# EAGLE design Cansat2019_1516_Container_v01 (EAGLE 7.3.0)
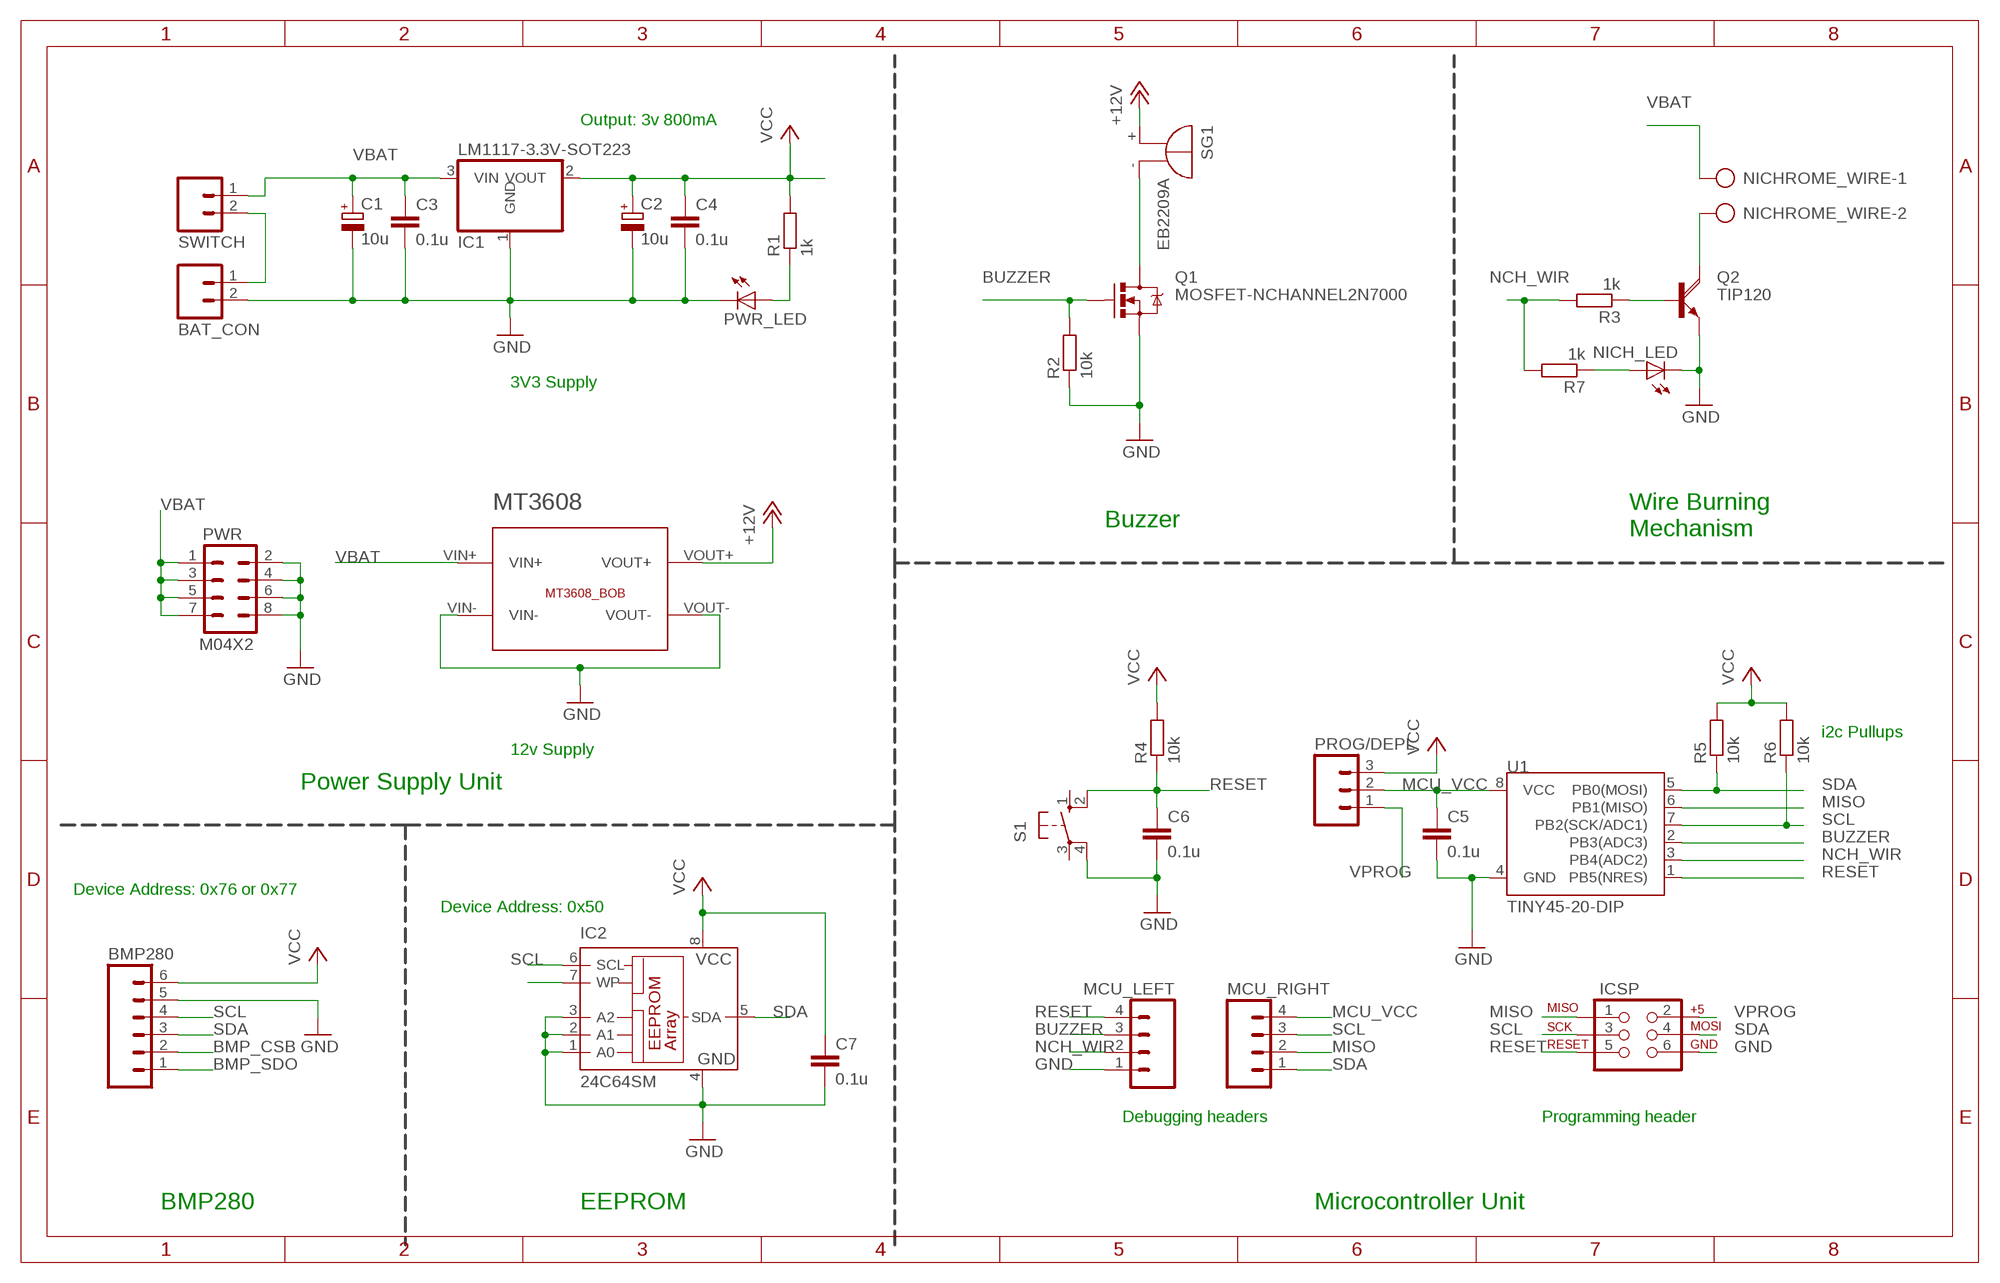
[diagram p0: schematic, sheet 1]

## Parts
BAT_CON  M02  [02P]
BMP280  M06  [06P]
C1  10u  CPOL-EUE2.5-6  [E2,5-6]
C2  10u  CPOL-EUE2.5-6  [E2,5-6]
C3  0.1u  C-EU025-025X050  [C025-025X050]
C4  0.1u  C-EU025-025X050  [C025-025X050]
C5  0.1u  C-EU025-025X050  [C025-025X050]
C6  0.1u  C-EU025-025X050  [C025-025X050]
C7  0.1u  C-EU025-025X050  [C025-025X050]
IC1  LM1117-3.3V-SOT223  [SOT223]
IC2  24C64SM  [SO-08M]
ICSP  AVR_SPI_PRG_6NS  [2X3-NS]
MCU_LEFT  M04  [04P]
MCU_RIGHT  M04  [04P]
MT3608  MT3608_BOB  [MT3608_BOB]
NICH_LED  LED3MM  [LED3MM]
NICHROME_WIRE  AK500/2-H  [AK500/2-H]
PROG/DEPL  M03PTH  [1X03]
PWR  M04X2  [2X4]
PWR_LED  LED3MM  [LED3MM]
Q1  MOSFET-NCHANNEL2N7000  [TO-92]
Q2  TIP120  [TO220AH]
R1  1k  R-EU_0204/7  [0204/7]
R2  10k  R-EU_0204/7  [0204/7]
R3  1k  R-EU_0204/7  [0204/7]
R4  10k  R-EU_0204/7  [0204/7]
R5  10k  R-EU_0204/7  [0204/7]
R6  10k  R-EU_0204/7  [0204/7]
R7  1k  R-EU_0204/7  [0204/7]
S1  PUSH-BUTTON-6MM  [B3F-10XX]
SG1  EB2209A  [EB2209A]
SWITCH  M02  [02P]
U1  TINY45-20-DIP  ATTINY45TINY45-20-DIP  [DIP08]

## Nets
+12V [power]: MT3608.VOUT+ SG1.+
BMP_CSB: BMP280.2
BMP_SDO: BMP280.1
BUZZER: MCU_LEFT.3 Q1.2(G) R2.2 U1.2(PB3(ADC3))
GND [power]: BAT_CON.2 BMP280.5 C1.- C2.- C3.2 C4.2 C5.2 C6.2 C7.2 IC1.1(GND) IC2.1(A0) IC2.2(A1) IC2.3(A2) IC2.4(GND) ICSP.6 MCU_LEFT.1 MT3608.VIN- MT3608.VOUT- NICH_LED.K(C) PWR.2 PWR.4 PWR.6 PWR.8 PWR_LED.K(C) Q1.1(S) Q2.E R2.1 S1.4(P1) U1.4(GND)
MCU_VCC [power]: C5.1 MCU_RIGHT.4 PROG/DEPL.2 U1.8(VCC)
MISO: ICSP.1 MCU_RIGHT.2 U1.6(PB1(MISO))
N$1 [power]: Q1.3(D) SG1.-
N$2 [burner]: NICHROME_WIRE.2 Q2.C
N$3: PWR_LED.A R1.1
N$4: Q2.B R3.1
N$5: NICH_LED.A R7.1
N$6 [burner]: BAT_CON.1 SWITCH.2
N$8: IC2.7(WP)
NCH_WIR: MCU_LEFT.2 R3.2 R7.2 U1.3(PB4(ADC2))
RESET: C6.1 ICSP.5 MCU_LEFT.4 R4.1 S1.2(S1) U1.1(PB5(NRES))
SCL: BMP280.4 IC2.6(SCL) ICSP.3 MCU_RIGHT.3 R6.1 U1.7(PB2(SCK/ADC1))
SDA: BMP280.3 IC2.5(SDA) ICSP.4 MCU_RIGHT.1 R5.1 U1.5(PB0(MOSI))
VBAT [burner]: C1.+ C3.1 IC1.3(VIN) MT3608.VIN+ NICHROME_WIRE.1 PWR.1 PWR.3 PWR.5 PWR.7 SWITCH.1
VCC [power]: BMP280.6 C2.+ C4.1 C7.1 IC1.2(VOUT) IC2.8(VCC) PROG/DEPL.3 R1.2 R4.2 R5.2 R6.2
VPROG [power]: ICSP.2 PROG/DEPL.1
Unconnected: S1.1(S) S1.3(P)

## Notes on the sheet
- Output: 3v 800mA
- 3V3 Supply
- Buzzer
- Wire Burning
  Mechanism
- i2c Pullups
- 12v Supply
- Power Supply Unit
- Device Address: 0x76 or 0x77
- Device Address: 0x50
- Debugging headers | Programming header
- BMP280 | EEPROM | Microcontroller Unit

## Library data of the parts
BAT_CON SWITCH = CEDT_JANUARY_2015_v5:M02: AMP QUICK CONNECTOR
BMP280 = con-amp-quick:M06: AMP QUICK CONNECTOR; OC_FARNELL: unknown; OC_NEWARK: unknown
C1 C2 = rcl:CPOL-EU: POLARIZED CAPACITOR, European symbol
C3-C7 = rcl:C-EU: CAPACITOR, European symbol
IC1 = msp framework:LM1117: LM1117 800mA Low Dropout (LDO) Positive Regulator 1.8V, 2.5V, 2.85V, 3.3V, 5V, and Adj Datasheet <www.ti.com/lit/ds/symlink/lm1117.pdf>; SUNROM: 4004
IC2 = microchip:24*: Serial EEPROM I2C; MF: RAMTRON INTERNATIONAL CORP; MPN: FM24C64-S; OC_FARNELL: 9882685; OC_NEWARK: 98H0189
ICSP = SparkFun-Connectors:AVR_SPI_PRG_6: AVR ISP 6 Pin This is the reduced ISP connector for AVR programming. Common on Arduino. This footprint will take up less PCB space and can be used with a 10-pin to 6-pin adapter such as SKU: BOB-08508 **Special note about "TEST_POINT" package. The stop mask is on the top side, so if you want your programming test points to be on the bottom of your board, make sure to place this package on the bottom side of the board. This also ensure that the orientation to program from the bottom side will be correct.
MCU_LEFT MCU_RIGHT = con-amp-quick:M04: AMP QUICK CONNECTOR; OC_FARNELL: unknown; OC_NEWARK: unknown
MT3608 = Breakouts:MT3608_BOB
NICH_LED PWR_LED = 01_adafruit:LED: LED OSRAM: - CHIPLED LG R971, LG N971, LY N971, LG Q971, LY Q971, LO R971, LY R971 LH N974, LH R974 LS Q976, LO Q976, LY Q976 LO Q996 - Hyper CHIPLED LW Q18S LB Q993, LB Q99A, LB R99A - SideLED LS A670, LO A670, LY A670, LG A670, LP A670 LB A673, LV A673, LT A673, LW A673 LH A674 LY A675 LS A676, LA A676, LO A676, LY A676, LW A676 LS A679, LY A679, LG A679 - Hyper Micro SIDELED® LS Y876, LA Y876, LO Y876, LY Y876 LT Y87S - SmartLED LW L88C, LW L88S LB L89C, LB L89S, LG L890 LS L89K, LO L89K, LY L89K LS L896, LA L896, LO L896, LY L896 - TOPLED LS T670, LO T670, LY T670, LG T670, LP T670 LSG T670, LSP T670, LSY T670, LOP T670, LYG T670 LG T671, LOG T671, LSG T671 LB T673, LV T673, LT T673, LW T673 LH T674 LS T676, LA T676, LO T676, LY T676, LB T676, LH T676, LSB T676, LW T676 LB T67C, LV T67C, LT T67C, LS T67K, LO T67K, LY T67K, LW E67C LS E67B, LA E67B, LO E67B, LY E67B, LB E67C, LV E67C, LT E67C LW T67C LS T679, LY T679, LG T679 LS T770, LO T770, LY T770, LG T770, LP T770 LB T773, LV T773, LT T773, LW T773 LH T774 LS E675, LA E675, LY E675, LS T675 LS T776, LA T776, LO T776, LY T776, LB T776 LHGB T686 LT T68C, LB T68C - Hyper Mini TOPLED® LB M676 - Mini TOPLED Santana® LG M470 LS M47K, LO M47K, LY M47K Source: http://www.osram.convergy.de/
NICHROME_WIRE = con-ptr500:AK500/2-H: CONNECTOR Aug. 2004 / PTR Meßtechnik: Die Bezeichnung der Serie AK505 wurde geändert. Es handelt sich hierbei um AK500 in horizontaler Ausführung.; OC_FARNELL: unknown; OC_NEWARK: unknown
PROG/DEPL = SparkFun-Connectors:M03: Header 3 Standard 3-pin 0.1" header. Use with straight break away headers (SKU : PRT-00116), right angle break away headers (PRT-00553), swiss pins (PRT-00743), machine pins (PRT-00117), and female headers (PRT-00115). Molex polarized connector foot print use with SKU : PRT-08232 with associated crimp pins and housings.
PWR = SparkFun-Connectors:M04X2: .1" header, two rows of four.
Q1 = SparkFun-DiscreteSemi:MOSFET-NCHANNEL: Common NMOSFET Parts MFG P/N Store ID Prod ID FDD8780 TRANS-09984 SI7820DN TRANS-11055 FDS6630A IC-08089 2N7002PW TRANS-11151 FQP30N06L COM-10213 TRANS-10060 BSS123LT1G TRANS-08345 BSS138 TRANS-00830 BS170 2N7000
Q2 = transistor-power:TIP120: NPN DARLINGTON TRANSISTOR
R1-R7 = rcl:R-EU_: RESISTOR, European symbol
S1 = msp framework:PUSH-BUTTON: Tactile Switch Momentary Push to ON switch Omron B3F 10-xx & 40-xx Datasheet <http://www.omron.com/ecb/products/pdf/en-b3f.pdf>; SUNROM: 3951
SG1 = buzzer:EB2209A: BUZZER Source: Buerklin; OC_FARNELL: unknown; OC_NEWARK: unknown
U1 = SparkFun-DigitalIC:ATTINY45: Atmel 8-pin 2/4/8kB flash uC; PROD_ID: IC-09439

## Net classes
0 default: width 0.305 mm, clearance 0.305 mm
1 power: width 0.61 mm, clearance 0.305 mm
2 burner: width 0.813 mm, clearance 0.305 mm

## Board
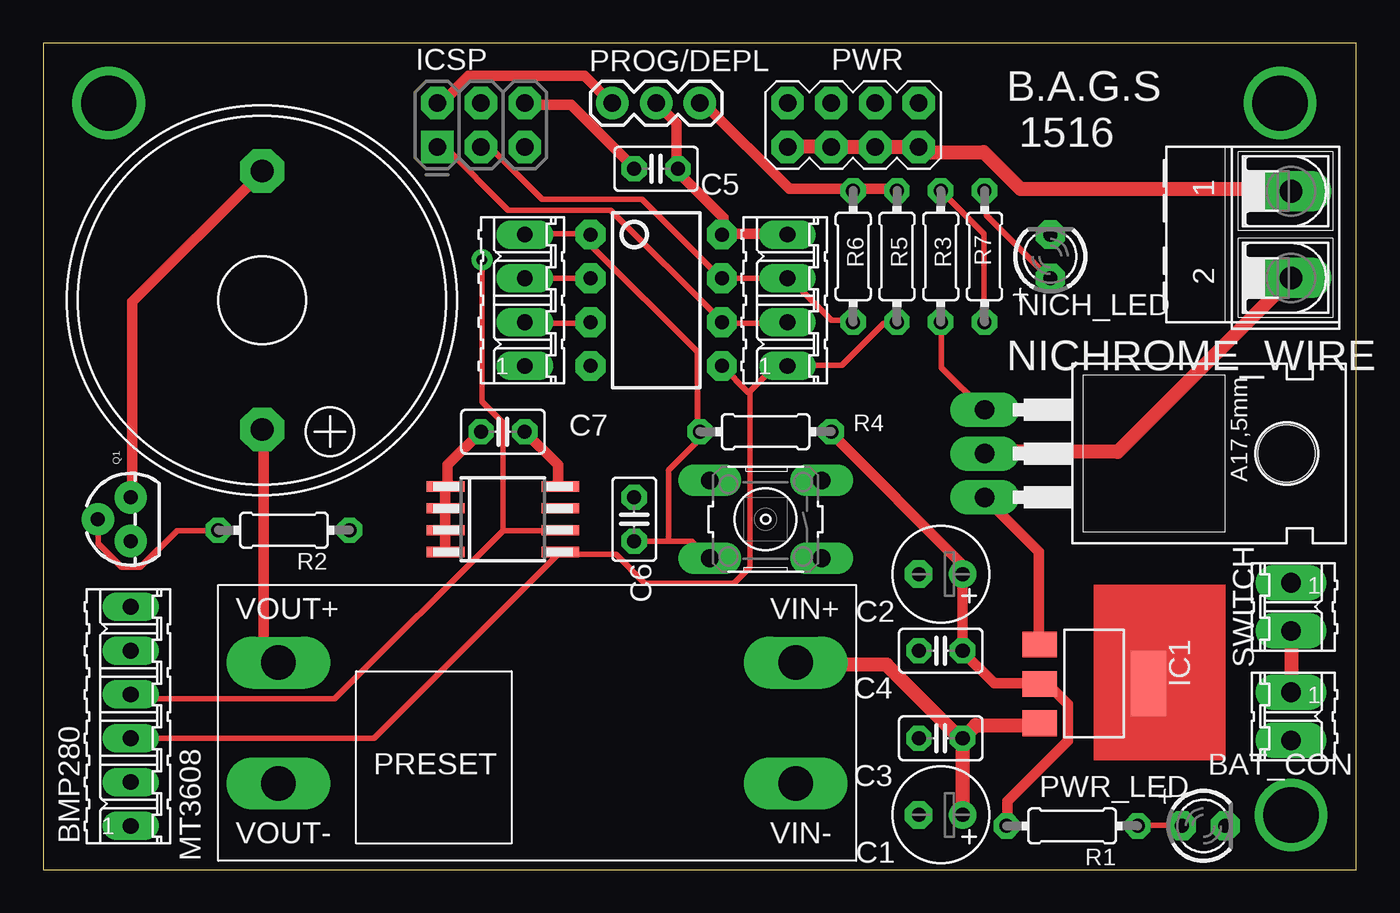
[diagram p1: board, top side]
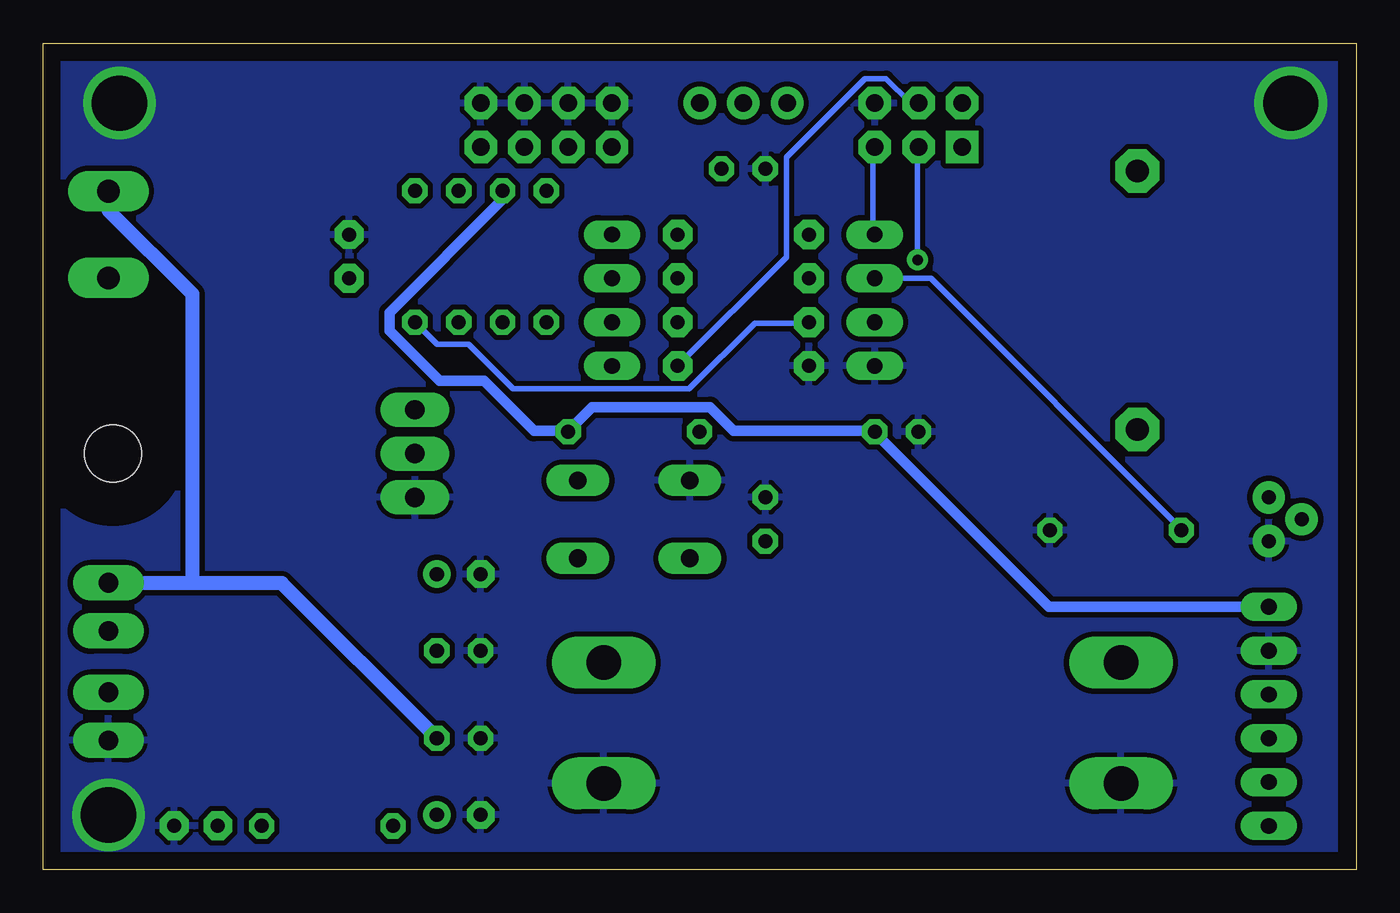
[diagram p2: board, bottom side, seen from below]

Size 76.18 x 47.93 mm. Coordinates in mm from the lower left corner, seen from the top.
Outline: 0,0 76.18,0 76.18,47.93 0,47.93 0,0
Copper layers (1*16): Top 0.035mm / dielectric 1.5mm / Bottom 0.035mm
Design rules "8085_board": minimum track width 10mil, minimum drill 24mil, track to track 8mil, track to pad 8mil, pad to pad 8mil, via to via 8mil, smd to smd 8mil, copper to edge 40mil, drill to drill 8mil, minimum pad ring 12mil, minimum via ring 12mil, stop-mask expansion 4mil, vias tented up to drill 0mil, thermal gap 10mil

### Footprints (pad centres in the part's own frame; a part is rotated, then mirrored left to right if it is on the bottom)
02P = drill 1.143 long: 1 -1.397,0; 2 1.397,0
06P = drill 0.914 long: 1 -6.35,0; 2 -3.81,0; 3 -1.27,0; 4 1.27,0; 5 3.81,0; 6 6.35,0
E2,5-6 = drill 0.813 pad 1.6: + -1.27,0 | drill 0.813 pad 1.6 octagon: - 1.27,0
C025-025X050 = drill 0.813 octagon: 1 -1.27,0; 2 1.27,0
SOT223 = smd 1.499 x 2.007: 1 -2.261,-3.15; 2 0.025,-3.15; 3 2.311,-3.15 | smd 3.81 x 2.007: 4 0,3.15
SO-08M = smd 0.6 x 2.2: 1 -1.905,-3.33; 2 -0.635,-3.33; 3 0.635,-3.33; 4 1.905,-3.33; 5 1.905,3.33; 6 0.635,3.33; 7 -0.635,3.33; 8 -1.905,3.33
2X3-NS = drill 1.016 pad 1.88 square: 1 -2.54,-1.27 | drill 1.016 pad 1.88 octagon: 2 -2.54,1.27; 3 0,-1.27; 4 0,1.27; 5 2.54,-1.27; 6 2.54,1.27
04P = drill 0.914 long: 1 -3.81,0; 2 -1.27,0; 3 1.27,0; 4 3.81,0
MT3608_BOB = drill 2 pad 3 long: VIN+ 33.5,-4.5; VIN- 33.5,-11.5; VOUT+ 3.5,-4.5; VOUT- 3.5,-11.5
LED3MM = drill 0.813 pad 1.676 octagon: A -1.27,0; K 1.27,0
AK500/2-H = drill 1.321 long: 1 -2.515,0; 2 2.515,0
1X03 = drill 1.016 pad 1.88: 1 0,0; 2 2.54,0; 3 5.08,0
2X4 = drill 1.016 pad 1.88 octagon: 1 -3.81,-1.27; 2 -3.81,1.27; 3 -1.27,-1.27; 4 -1.27,1.27; 5 1.27,-1.27; 6 1.27,1.27; 7 3.81,-1.27; 8 3.81,1.27
TO-92 = drill 0.813 pad 1.88: 1 -1.27,0; 2 0,1.905; 3 1.27,0
TO220AH = drill 1.118 long: B -2.54,-6.35; C 0,-6.35; E 2.54,-6.35 | hole 3.302: 0,11.176
0204/7 = drill 0.813 octagon: 1 -3.81,0; 2 3.81,0
B3F-10XX = drill 1.016 long: 1 -3.251,2.261; 2 3.251,2.261; 3 -3.251,-2.261; 4 3.251,-2.261
EB2209A = drill 1.321 pad 2.54 octagon: + 7.493,0; - -7.493,0
DIP08 = drill 0.813 pad 1.727 octagon: 1 -3.81,-3.81; 2 -1.27,-3.81; 3 1.27,-3.81; 4 3.81,-3.81; 5 3.81,3.81; 6 1.27,3.81; 7 -1.27,3.81; 8 -3.81,3.81

### Placement (x,y rotation side)
BAT_CON  72.39,8.89 270 top
BMP280  5.08,8.89 90 top
C1  52.07,3.17 180 top
C2  52.07,17.14 180 top
C3  52.07,7.62 180 top
C4  52.07,12.7 180 top
C5  35.56,40.64 180 top
C6  34.29,20.32 90 top
C7  26.67,25.4 180 top
IC1  60.96,10.79 270 top
IC2  26.67,20.32 270 top
ICSP  25.4,43.18 0 top
MCU_LEFT  27.94,33.02 90 top
MCU_RIGHT  43.18,33.02 90 top
MT3608  10.16,16.51 0 top
NICH_LED  58.42,35.56 90 top
NICHROME_WIRE  72.39,36.83 270 top
PROG/DEPL  33.02,44.45 0 top
PWR  46.99,43.18 0 top
PWR_LED  67.31,2.54 0 top
Q1  5.08,20.32 90 top
Q2  60.96,24.13 270 top
R1  59.69,2.54 180 top
R2  13.97,19.68 180 top
R3  52.07,35.56 90 top
R4  41.91,25.4 0 top
R5  49.53,35.56 90 top
R6  46.99,35.56 90 top
R7  54.61,35.56 270 top
S1  41.91,20.32 180 top
SG1  12.7,33.02 270 top
SWITCH  72.39,15.24 270 top
U1  35.56,33.02 270 top

### Tracks (layer width: path | path; a pad name or v marks a point on that pad's centre or on a via)
+12V
  Top 0.61: SG1.+ 12.8,25.45 12.8,12.8 13.56,12.04 MT3608.VOUT+
BUZZER
  Top 0.305: U1.2 MCU_LEFT.3 | R2.2 10.06,19.66 7.77,19.66 5.64,17.53 4.57,17.53 3.2,18.9 3.2,20.27 Q1.2
  Bottom 0.305: MCU_LEFT.3 24.69,34.29 10.21,19.81 R2.2
GND  (via drill 3.2)
  Top 0.61: IC2.4 23.32,18.44 23.32,19.66 IC2.3 23.32,19.96 23.32,20.88 IC2.2 23.32,21.18 23.32,22.1 IC2.1 23.47,22.4 23.47,23.47 C7.2 | Q2.E 57.76,18.44 57.76,13.11 IC1.1 | ICSP.6 28.04,44.35 30.63,44.35 34.29,40.69 C5.2
  other vias: 3.81,44.45 71.75,44.45 72.39,3.17
  pour Bottom: 1.27,48.26 1.27,0 76.2,0 76.2,48.26
MCU_VCC
  Top 0.61: MCU_RIGHT.4 43.13,36.88 39.47,36.88 U1.8 39.47,37.19 39.47,37.8 36.88,40.39 C5.1 36.73,40.69 36.73,43.28 PROG/DEPL.2
MISO
  Top 0.305: MCU_RIGHT.2 43.13,31.7 39.47,31.7 U1.6 39.32,31.85 32.92,38.25 26.98,38.25 23.32,41.91 ICSP.1
N$1
  Top 0.61: Q1.3 5.18,21.64 5.18,32.92 12.65,40.39 SG1.-
N$2
  Top 0.813: Q2.C 54.71,24.23 62.33,24.23 72.39,34.29 NICHROME_WIRE.2
N$3
  Top 0.305: R1.1 63.55,2.59 65.99,2.59 PWR_LED.A
N$4
  Top 0.305: R3.1 52.12,31.7 52.12,29.11 54.56,26.67 Q2.B
N$5
  Top 0.305: R7.1 54.71,39.32 54.71,37.95 58.37,34.29 NICH_LED.A
N$6
  Top 0.813: SWITCH.2 BAT_CON.1
NCH_WIR
  Top 0.305: MCU_LEFT.2 28.04,31.7 31.7,31.7 U1.3 | R3.2 54.56,36.88 54.56,31.85 R7.2
  Bottom 0.305: R7.2 53.34,30.48 51.51,30.48 48.92,27.89 38.71,27.89 34.9,31.7 31.85,31.7 U1.3
RESET
  Top 0.305: MCU_LEFT.4 28.04,36.88 31.7,36.88 U1.1 31.85,36.73 31.85,36.12 37.95,30.02 37.95,25.6 38.1,25.45 R4.1 38.1,24.99 36.27,23.16 36.27,19.05 | 36.27,19.05 37.64,19.05 38.56,18.14 S1.2 | 36.27,19.05 C6.1
  Bottom 0.305: ICSP.5 28.04,41.91 28.04,36.88 MCU_LEFT.4
SCL  (via drill 0.61)
  Top 0.305: R6.1 46.94,31.85 45.72,31.85 43.28,34.29 MCU_RIGHT.3 U1.7 39.32,34.29 34.75,38.86 28.96,38.86 25.91,41.91 ICSP.3 | 26.67,19.66 29.87,19.66 IC2.6 | 26.67,19.66 16.92,9.91 5.33,9.91 BMP280.4 | v25.45,35.36 25.45,27.13 26.67,25.91 26.67,19.66
  Bottom 0.305: v25.45,35.36 25.45,41.91 ICSP.3
SDA
  Top 0.305: R5.1 49.53,31.7 48.77,31.7 46.33,29.26 43.28,29.26 MCU_RIGHT.1 43.13,29.11 42.37,29.11 40.92,27.66 | U1.5 40.92,27.66 | 40.92,27.66 41,27.58 41,17.53 40.08,16.61 34.9,16.61 33.22,18.29 30.02,18.29 IC2.5 29.87,18.29 19.2,7.62 BMP280.3
  Bottom 0.305: U1.5 33.07,35.51 33.07,41.3 28.5,45.87 27.28,45.87 25.91,44.5 25.45,44.5 ICSP.4
VBAT
  Top 0.813: PWR.1 PWR.3 PWR.5 PWR.7 51.05,41.6 54.56,41.6 56.69,39.47 72.39,39.47 NICHROME_WIRE.1 | C3.1 54.1,8.38 57.76,8.38 IC1.3 | C3.1 C1.+ | MT3608.VIN+ 43.74,11.89 48.92,11.89 53.03,7.77 C3.1
  Bottom 0.813: 67.51,16.61 62.33,16.61 C3.1 | 67.51,16.61 72.39,16.61 SWITCH.1 | NICHROME_WIRE.1 72.39,38.25 67.51,33.38 67.51,16.61
VCC
  Top 0.61: C7.1 29.87,23.47 29.87,22.25 IC2.8 | R5.2 49.53,39.47 47.09,39.47 R6.2 46.79,39.47 43.28,39.47 38.41,44.35 38.1,44.35 PROG/DEPL.3 | R1.2 55.93,2.59 55.93,3.96 59.44,7.47 59.44,9.6 58.37,10.67 58.06,10.67 IC1.2 57.76,10.82 55.17,10.82 53.34,12.65 C4.1 C2.+ 53.34,17.68 45.72,25.3 R4.2
  Bottom 0.61: BMP280.6 17.83,15.24 27.89,25.3 C7.1 28.19,25.45 36.12,25.45 37.49,26.82 44.35,26.82 45.57,25.6 R4.2 45.72,25.45 47.7,25.45 50.6,28.35 53.19,28.35 56.08,31.24 56.08,32.31 49.53,38.86 R5.2
  pour Top: 68.58,6.35 60.96,6.35 60.96,16.51 68.58,16.51
VPROG
  Top 0.61: ICSP.2 22.86,44.5 23.16,44.5 24.69,46.02 31.39,46.02 32.92,44.5 PROG/DEPL.1
(copper drawn outside any net)
  shapes: Top area x1

### Text on the board
tNames: B.A.G.S / 1516